# Altium schematic sheet RFFE_Controller.SchDoc
size A3
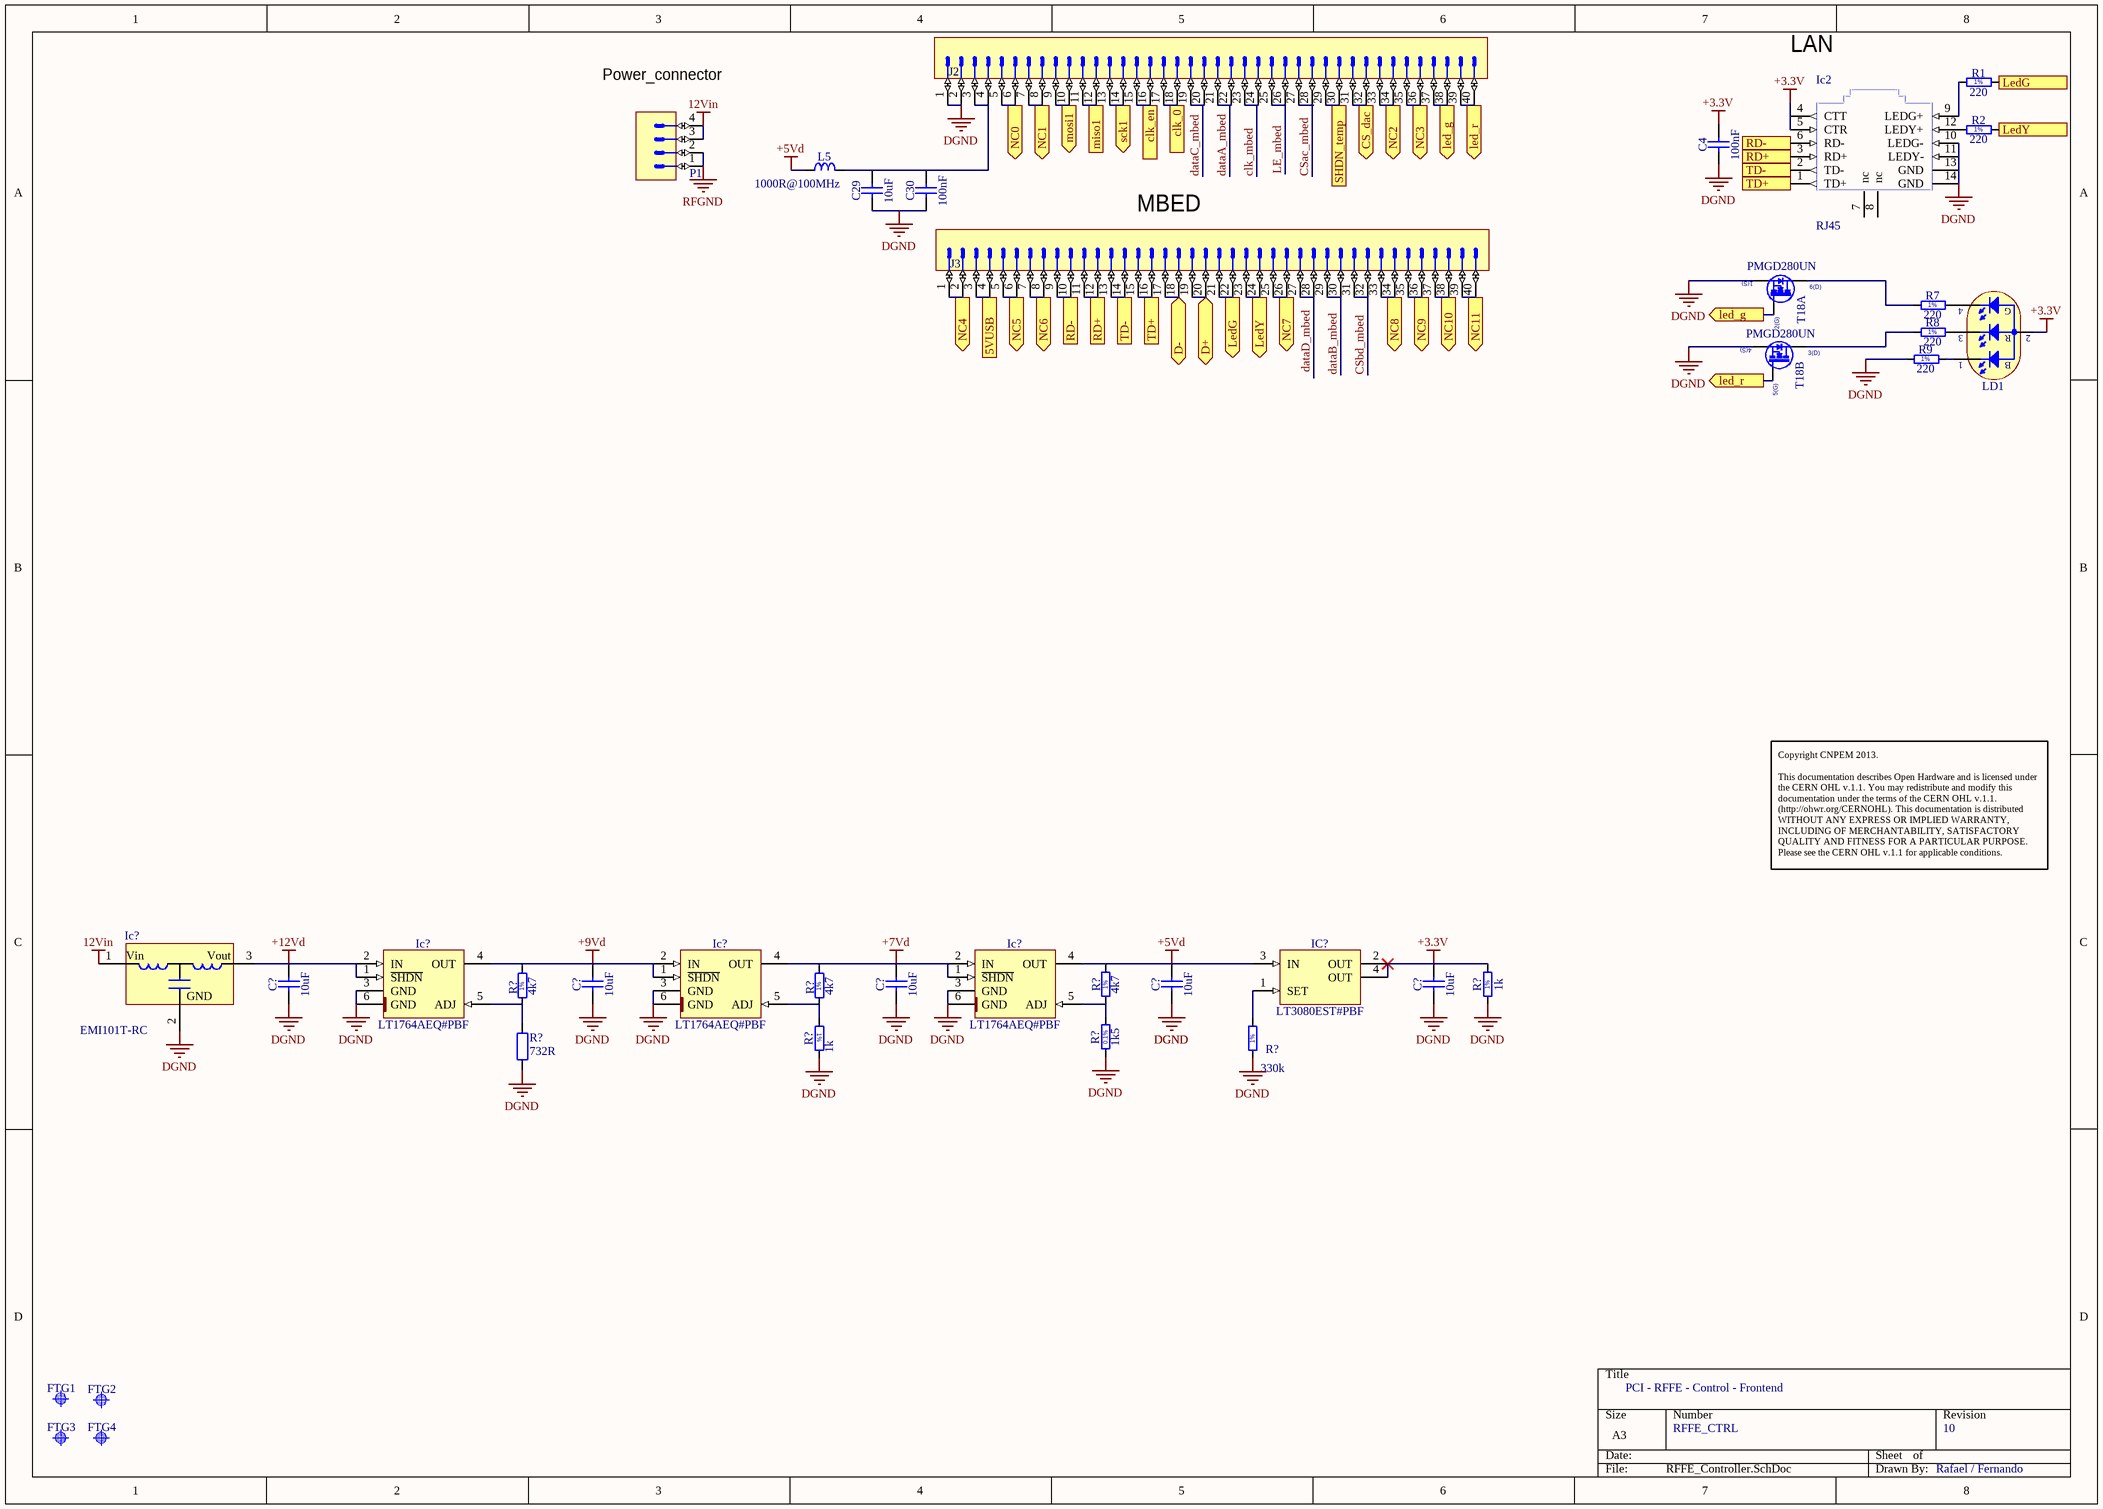
[diagram p0: RFFE_Controller.SchDoc]

## Parts
(Parts that share a designator on the sheet are numbered #1, #2 ... from top to bottom, then left to right.)
C4  100nF  [CAPC1608X87N]
C29  10uF  [CAPC3216X180N]
C30  100nF  [CAPC1608X87N]
C?#1  10uF  [CAPC3216X180N]
C?#2  10uF  [CAPC3216X180N]
C?#3  10uF  [CAPC3216X180N]
C?#4  10uF  [CAPC3216X180N]
C?#5  10uF  [CAPC3216X180N]
FTG1  Use only in PCB  [FIDUCIAL_TOP_S100-200]  (value not drawn)
FTG2  Use only in PCB  [FIDUCIAL_TOP_S100-200]  (value not drawn)
FTG3  Use only in PCB  [FIDUCIAL_TOP_S100-200]  (value not drawn)
FTG4  Use only in PCB  [FIDUCIAL_TOP_S100-200]  (value not drawn)
Ic2  RJ45  [J0006D21BNL]
Ic?#1  LT1764AEQ#PBF  [TO170P1394X457-6N-R900X1060]
Ic?#2  LT1764AEQ#PBF  [TO170P1394X457-6N-R900X1060]
Ic?#3  LT1764AEQ#PBF  [TO170P1394X457-6N-R900X1060]
IC?#4  LT3080EST#PBF  [SOT230P700X180-4N]
Ic?#5  EMI101T-RC  [Filter_EMI_Radial-3]
J2  (no value)  [TYCO_2-534998-0]
J3  (no value)  [TYCO_2-534998-0]
L5  1000R@100MHz  [INDC1608X95N]
LD1  Blue/Red/Green  [LED_AVAGO_HSMF-C113]  (value not drawn)
P1  Header 4  [JST_B4B-XH-A(LF)(SN)]  (value not drawn)
R1  220  [RESC2012X60N]
R2  220  [RESC2012X60N]
R7  220  [RESC2012X60N]
R8  220  [RESC2012X60N]
R9  220  [RESC2012X60N]
R?#1  4k7  [RESC1608X55N]
R?#2  4k7  [RESC1608X55N]
R?#3  4k7  [RESC1608X55N]
R?#4  1k  [RESC1608X55N]
R?#5  1k  [RESC1608X55N]
R?#6  1k5  [RESC2012X60N]
R?#7  330k  [RESC2012X60N]
R?#8  732R
T18  PMGD280UN  [SOT65P210X110-6N]  (parts A,B of 2)

## Ports
5VUSB, clk_0, clk_en, CS_dac (out), D+ (bidir), D- (bidir), led_g (out), led_r (out), LedG, LedG (out), LedY, LedY (out), miso1, mosi1 (out), NC0 (out), NC1 (out), NC2 (out), NC3 (out), NC4 (out), NC5 (out), NC6 (out), NC7 (out), NC8 (out), NC9 (out), NC10 (out), NC11 (out), RD+, RD-, sck1 (out), SHDN_temp, TD+, TD-

## Nets
12Vin: Ic?#5.1(Vin) P1.3 P1.4
+3.3V: C4.2 C?#5.2 Ic2.4(CTT) Ic2.5(CTR) IC?#4.2(OUT) IC?#4.4(OUT) LD1.2(AC) R?#4.2
+5Vd: C?#4.2 Ic?#3.4(OUT) IC?#4.3(IN) L5.1 R?#3.2
+7Vd: C?#3.2 Ic?#2.4(OUT) Ic?#3.1(~{SHDN}) Ic?#3.2(IN) R?#2.2
+9Vd: C?#2.2 Ic?#1.4(OUT) Ic?#2.1(~{SHDN}) Ic?#2.2(IN) R?#1.2
+12Vd: C?#1.2 Ic?#1.1(~{SHDN}) Ic?#1.2(IN) Ic?#5.3(Vout)
DGND: C4.1 C29.1 C30.1 C?#1.1 C?#2.1 C?#3.1 C?#4.1 C?#5.1 Ic2.10(LEDG-) Ic2.11(LEDY-) Ic2.13(GND) Ic2.14(GND) Ic?#1.3(GND) Ic?#1.6(GND) Ic?#2.3(GND) Ic?#2.6(GND) Ic?#3.3(GND) Ic?#3.6(GND) Ic?#5.2(GND) J2.1 J2.2 R9.1 R?#4.1 R?#5.2 R?#6.1 R?#7.1 R?#8.1 T18.1(S) T18.4(S)
RFGND: P1.1 P1.2
5VUSB: J3.3 J3.4 ; port 5VUSB
clk_0: J2.17 J2.18 ; port clk_0
clk_en: J2.15 J2.16 ; port clk_en
clk_mbed: J2.23 J2.24
CS_dac: J2.31 J2.32 ; port CS_dac
CSac_mbed: J2.27 J2.28
CSbd_mbed: J3.31 J3.32
D+: J3.19 J3.20 ; port D+
D-: J3.17 J3.18 ; port D-
dataA_mbed: J2.21 J2.22
dataB_mbed: J3.29 J3.30
dataC_mbed: J2.19 J2.20
dataD_mbed: J3.27 J3.28
LE_mbed: J2.25 J2.26
led_g: J2.37 J2.38 T18.2(G) ; port led_g
led_r: J2.39 J2.40 T18.5(G) ; port led_r
LedG: J3.21 J3.22 R1.2 ; port LedG
LedY: J3.23 J3.24 R2.2 ; port LedY
miso1: J2.11 J2.12 ; port miso1
mosi1: J2.9 J2.10 ; port mosi1
NC0: J2.5 J2.6 ; port NC0
NC1: J2.7 J2.8 ; port NC1
NC2: J2.33 J2.34 ; port NC2
NC3: J2.35 J2.36 ; port NC3
NC4: J3.1 J3.2 ; port NC4
NC5: J3.5 J3.6 ; port NC5
NC6: J3.7 J3.8 ; port NC6
NC7: J3.25 J3.26 ; port NC7
NC8: J3.33 J3.34 ; port NC8
NC9: J3.35 J3.36 ; port NC9
NC10: J3.37 J3.38 ; port NC10
NC11: J3.39 J3.40 ; port NC11
RD+: Ic2.3(RD+) J3.11 J3.12 ; port RD+
RD-: Ic2.6(RD-) J3.9 J3.10 ; port RD-
sck1: J2.13 J2.14 ; port sck1
SHDN_temp: J2.29 J2.30 ; port SHDN_temp
TD+: Ic2.1(TD+) J3.15 J3.16 ; port TD+
TD-: Ic2.2(TD-) J3.13 J3.14 ; port TD-
NetC29_2: C29.2 C30.2 J2.3 J2.4 L5.2
NetIc2_9: Ic2.9(LEDG+) R1.1
NetIc2_12: Ic2.12(LEDY+) R2.1
NetIc?#1_5: Ic?#1.5(ADJ) R?#1.1 R?#8.2
NetIc?#2_5: Ic?#2.5(ADJ) R?#2.1 R?#5.1
NetIc?#3_5: Ic?#3.5(ADJ) R?#3.1 R?#6.2
NetIC?#4_1: IC?#4.1(SET) R?#7.2
NetLD1_1: LD1.1(CB) R9.2
NetLD1_3: LD1.3(CR) R8.2
NetLD1_4: LD1.4(CG) R7.2
NetR7_1: R7.1 T18.6(D)
NetR8_1: R8.1 T18.3(D)

Not connected (* = marked no-connect by the designer): Ic2 7(nc) 8(nc)

## Notes on the sheet
- (near P1) Power_connector
- LAN
- (near J3) MBED
- Copyright CNPEM 2013.
  This documentation describes Open Hardware and is licensed under the CERN OHL v.1.1. You may redistribute and modify this documentation under the terms of the CERN OHL v.1.1. (http://ohwr.org/CERNOHL). This documentation is distributed WITHOUT ANY EXPRESS OR IMPLIED WARRANTY, INCLUDING OF MERCHANTABILITY, SATISFACTORY QUALITY AND FITNESS FOR A PARTICULAR PURPOSE. Please see the CERN OHL v.1.1 for applicable conditions.
- PCI - RFFE - Control - Frontend
- RFFE_CTRL
- 10
- Rafael / Fernando
- (in symbol LED_AVAGO_HSMF-C113) G; R; B
- (in symbol PMGD280UN, part A) 6(D); 1(S); 2(G)
- (in symbol PMGD280UN, part B) 3(D); 4(S); 5(G)
- (in symbol R0603_1K_1%_0.1W_100PPM) 1%
- (in symbol R0603_4K7_1%_0.1W_100PPM) 1%
- (in symbol R0805_1K5_0.1%_0.1W_10PPM) 0.1%
- (in symbol R0805_220R_1%_0.125W_100PPM) 1%
- (in symbol R0805_330K_1%_0.125W_100PPM) 1%

## Library data of the parts
C4 C30 = CC0603_100NF_50V_10%_X7R: Non-polarised capacitor; Manufacturer: GENERIC; Part Description: SMD Multilayer Chip Ceramic Capacitor; Manufacturer1 Part Number: 223858615649; Tolerance: ±10%; Voltage: 50V; TC: X7R; Manufacturer Part Number: CC0603_100NF_50V_10%_X7R; Part Number: CC0603_100NF_50V_10%_X7R; Component Kind: Standard; Component Type: Standard; Pin Count: 2; Value: 100nF; Status: Preferred; Case: 0603; Mounted: Yes; Socket: No; SMD: Yes; Sense: No; Manufacturer1 Example: PHYCOMP; Manufacturer1 ComponentHeight: 0.87mm; HelpURL: \\cern.ch\dfs\Applications\Altium\Datasheets\CC0603_X7R_PHYCOMP.pdf; Author: CERN DEM JLC; CreateDate: 03/12/2007; LatestRevisionDate: 03/12/2007
C29 C?#1-C?#5 = CC1206_10UF_25V_10%_X7R: Non-polarised capacitor; Manufacturer: GENERIC; Part Description: SMD Multilayer Chip Ceramic Capacitor; Manufacturer1 Part Number: C1206C106K4RACTU; Tolerance: ±10%; Voltage: 25V; TC: X7R; Manufacturer Part Number: CC1206_10uF_25V_10%_X7R; Part Number: CC1206_10UF_25V_10%_X7R; Component Kind: Standard; Component Type: Standard; Pin Count: 2; Value: 10uF; Status: Preferred; Case: 1206; Mounted: Yes; Socket: No; SMD: Yes; Sense: No; Manufacturer1 Example: KEMET; Manufacturer1 ComponentHeight: 1.8mm; HelpURL: \\cern.ch\dfs\Applications\Altium\Datasheets\CC1206_X7R_KEMET.pdf; Author: CERN DEM JLC; CreateDate: 12/09/2012; LatestRevisionDate: 12/09/2012
FTG1-FTG4 = FIDUCIAL_TARGET_S100-200: Fiducial Target; Part Description: Square Fiducial Target, Top Layer, 1.0mm, Top Solder 2.0mm, Keepout =2.0mm; Mounted: No; Part Number: FIDUCIAL_TARGET_S100-200; Component Kind: Standard (No BOM); Component Type: Standard (No BOM); Pin Count: 1; Family: Fiducial; Socket: No; SMD: Yes; Sense: No; Status: None; ComponentHeight: 0mm; HelpURL: Undefined; Author: CERN DEM JLC; CreateDate: 09/02/2010; LatestRevisionDate: 04/04/2012; PackageDescription: Square Fiducial Target, Top Layer, 1.0mm, Top Solder 2.0mm, Keepout =2.0mm
Ic2 = J0006D21BNL: CONN MAGJACK 1PORT 100 BASE-TX; Manufacturer: Pulse Electronics Corporation; Part Description: 1 Port, 1x1 Tab-Down 10/100BASE-TX RJ45 FastJack Connector Module With LEDs Y/G; Number of Ports: 1; LED Color: Green - Yellow; Number of Cores per Jack: 4; Shielding: Shielded; Tab Direction: Down; Shield Material: Brass; PressFit: No; Supplier 1: Digi-Key; Manufacturer Part Number: J0006D21BNL; RoHS: RoHS Compliant; Category: Connectors, Interconnects; Stock 1: 1565; Pricing 1: 1=6.38, 25=5.586, 50=5.32, 100=5.054, 250=4.522, 500=4.256, 1000=3.724, 2500=3.5378, 5000=3.458 (USD); Packaging: Bulk; Connector Type: RJ45; Number of Rows: 1; Applications: 10/100 Base-TX, AutoMDIX; Mounting Type: Through Hole; Orientation: 90° Angle (Right); Termination: Solder; Height Above Board: 0.545" (13.84mm); Features: Board Guide; Contact Material: Phosphor Bronze; Contact Finish: Gold; Contact Finish Thickness: 15µin (0.38µm); Housing Material: Thermoplastic; Operating Temperature: 0°C ~ 70°C; ComponentLink1URL: http://productfinder.pulseeng.com/products/datasheets/J403.pdf; ComponentLink1Description: http://productfinder.pulseeng.com/products/datasheets/J403.pdf; Supplier Part Number 1: J0006D21BNL; Part Number: J0006D21BNL; Component Kind: Standard; Component Type: Standard; Pin Count: 16; Family: RJ45; Mounted: Yes; Socket: No; SMD: No; Sense: No; Status: None; ComponentHeight: 13.84mm; HelpURL: http://productfinder.pulseeng.com/products/datasheets/J403.pdf; Author: LNLS DIG FCS; CreateDate: 28/06/2016; LatestRevisionDate: 28/06/2016
Ic?#1-Ic?#3 = LT1764AEQ#PBF: 3A, Fast Transient Response, Low Noise, LDO Regulators; Manufacturer: LINEAR TECHNOLOGY; Part Description: 2.5V 3A, Fast Transient Response, Low Noise, LDO Regulators; PressFit: No; Bonding: No; Manufacturer Part Number: LT1764AEQ#PBF; Part Number: LT1764AEQ#PBF; Component Kind: Standard; Component Type: Standard; Device: LT1764AEQ#PBF; PackageDescription: TO, 1.70mm Pitch; 5 Pin, 13.945mm L X 8.89mm W X 4.572mm H body, IPC Medium Density; Pin Count: 6; Case: TO-263; Mounted: Yes; Socket: No; SMD: Yes; Sense: No; ComponentHeight: 4.57mm; Author: LNLS DIG GBMB; CreateDate: 17/02/2017; LatestRevisionDate: 17/02/2017
IC?#4 = LT3080EST#PBF: 200mA, Programmable Current Source; Part Description: 0 To 36V Adjustable 1.1A Single Resistor Low Dropout Regulator; Manufacturer: LINEAR TECHNOLOGY; PressFit: No; Bonding: No; Part Number: LT3080EST#PBF; Component Kind: Standard; Component Type: Standard; Device: LT3080EST#PBF; PackageDescription: SOT223, 2.30mm pitch; 3 pin, 3.70mm W X 6.70mm L, IPC Medium Density; Manufacturer Part Number: LT3080EST#PBF; Pin Count: 4; Case: SOT223; Mounted: Yes; Socket: No; SMD: Yes; Sense: No; ComponentHeight: 1.8mm; HelpURL: http://cds.linear.com/docs/en/datasheet/3080fc.pdf; Author: LNLS DIG FCS; CreateDate: 04/07/2016; LatestRevisionDate: 04/07/2016
Ic?#5 = EMI101T-RC: FILTER EMI 100PF 350-500MHZ 5A; Manufacturer: Bourns Inc.; Part Description: LC (T-Type) Low Pass Filter 1 Channel 5A 25dB @ 350MHz ~ 500MHz Radial - 3 Leads; Number of Channels: 1; Attenuation Value: 25dB @ 350MHz ~ 500MHz; Resistance - Channel (Ohms): 0.05; Values: C = 100pF; ESD Protection: No; Filter Order: 3rd; PressFit: No; Supplier 1: Digi-Key; RoHS: Vendor undefined; Category: Filters; Stock 1: 15905; Pricing 1: 1=0.27, 10=0.255, 25=0.2428, 50=0.2352, 100=0.2273, 250=0.21552, 500=0.18026, 1000=0.1399 (USD); Packaging: Cut Tape (CT); Type: Low Pass; Package / Case: Radial - 3 Leads; Size / Dimension: 0.354" L x 0.126" W (9.00mm x 3.20mm); Operating Temperature: -25°C ~ 85°C; ComponentLink1URL: http://www.bourns.com/data/global/pdfs/emi_t_series.pdf; ComponentLink1Description: http://www.bourns.com/data/global/pdfs/emi_t_series.pdf; Supplier Part Number 1: EMI_Filter; Manufacturer Part Number: EMI101T-RC; Technology: LC (T-Type); Center / Cutoff Frequency: -; Current: 5A; Applications: General Purpose; Height: 0.315" (8.00mm); Part Number: EMI101T-RC; Component Kind: Standard; Component Type: Standard; Device: EMI101T-RC; PackageDescription: 3 Leads In-Line Package, Pitch 2.54mm; Pin Count: 3; Case: Radial - 3 Leads; Mounted: Yes; Socket: Yes; SMD: No; Sense: No; Bonding: No; ComponentHeight: 8mm; Author: LNLS DIG FCS; HelpURL: http://www.bourns.com/docs/Product-Datasheets/emi_t_series.pdf; CreateDate: 04/07/2016; LatestRevisionDate: 04/07/2016
J2 J3 = TYCO_2-534998-0: Connector 40 Male; Part Description: 40 Contacts, Vertical Low Profile IDC Shrouded Header with Ejection Latches; Manufacturer: TYCO ELECTRONICS; PressFit: No; Part Number: TYCO_2-534998-0; Component Kind: Standard; Component Type: Standard; Pin Count: 40; Family: AMP-LATCH; Mounted: Yes; Socket: No; SMD: No; Sense: No; Status: None; Manufacturer Part Number: 2-534998-0; ComponentHeight: 6.22mm; HelpURL: http://www.te.com/commerce/DocumentDelivery/DDEController?Action=srchrtrv&DocNm=534998&DocType=Customer+Drawing&DocLang=English; Author: LNLS DIG FCS; CreateDate: 28/06/2016; LatestRevisionDate: 28/06/2016
L5 = IND0603_MURATA_BLM18HE102SN1: Inductor; Part Description: SMD EMIFIL Suppression Chip Ferrite Bead; Manufacturer: MURATA; Power: 600mA; Resistance: 0.35R; Tolerance: ±25%; Part Number: IND0603_MURATA_BLM18HE102SN1; Component Kind: Standard; Component Type: Standard; Pin Count: 2; Value: 1000R@100MHz; Status: None; Manufacturer Part Number: BLM18HE102SN1; Case: 0603; Mounted: Yes; Socket: No; SMD: Yes; Sense: No; ComponentHeight: 0.95mm; HelpURL: \\cern.ch\dfs\Applications\Altium\Datasheets\IND0603_MURATA_BLM18H.pdf; Author: CERN DEM JLC; CreateDate: 09/12/2013; LatestRevisionDate: 09/12/2013
LD1 = LED_AVAGO_HSMF-C113: Tricolor LEDs 1 Cathode Blue, 2 Common Anode, 3 Cathode Red, 4 Cathode Green; Part Description: Right Angle Tricolor (Blue, Red, Green) Surface Mount ChipLED; Manufacturer: AVAGO TECHNOLOGIES; PressFit: No; Bonding: No; Part Number: LED_AVAGO_HSMF-C113; Component Kind: Standard; Component Type: Standard; Color: Blue/Red/Green; PackageDescription: Right Angle Tricolor Surface Mount ChipLED, Body 2.5x1mm; Manufacturer Part Number: HSMF-C113; Pin Count: 4; Mounted: Yes; Socket: No; SMD: Yes; Sense: No; ComponentHeight: 1mm; HelpURL: \\cern.ch\dfs\Applications\Altium\Datasheets\LED_AVAGO_HSMF-C113.pdf; Author: CERN DEM JLC; CreateDate: 29/09/2010; LatestRevisionDate: 29/09/2010
P1 = JST_B4B-XH-A(LF)(SN): Connector 4 Male; Part Description: 4 Contacts, 2.5mm Pitch, Top Entry Type Shrouded Header; Manufacturer: JST (JAPAN SOLDERLESS TERMINALS); PressFit: No; LatestRevisionDate: 14/08/2014; Part Number: JST_B4B-XH-A(LF)(SN); Component Kind: Standard; Component Type: Standard; Pin Count: 4; Family: Header 4; Mounted: Yes; Socket: No; SMD: No; Sense: No; Status: None; Manufacturer Part Number: B4B-XH-A(LF)(SN); ComponentHeight: 7mm; HelpURL: \\cern.ch\dfs\Applications\Altium\Datasheets\JST_B4B-XH-A(LF)(SN).pdf; Author: CERN DEM JLC; CreateDate: 14/08/2014
R1 R2 R7-R9 = R0805_220R_1%_0.125W_100PPM: Resistor - 1%; Manufacturer: GENERIC; Part Description: General Purpose Thick Film Chip Resistor; Manufacturer1 Part Number: NRC10F2200TRF; Power: 0.125W; TC: ±100ppm/°C; Manufacturer Part Number: R0805_220R_1%_0.125W_100PPM; Tolerance: ±1%; Part Number: R0805_220R_1%_0.125W_100PPM; Component Kind: Standard; Component Type: Standard; Pin Count: 2; Value: 220; Status: Preferred; Case: 0805; Mounted: Yes; Sense: No; Socket: No; SMD: Yes; Manufacturer1 Example: NIC COMPONENT; Manufacturer1 ComponentHeight: 0.6mm; HelpURL: \\cern.ch\dfs\Applications\Altium\Datasheets\R0805_NIC_NRC.pdf; Author: CERN DEM JLC; CreateDate: 03/12/2007; LatestRevisionDate: 13/03/2008
R?#1-R?#3 = R0603_4K7_1%_0.1W_100PPM: Resistor - 1%; Manufacturer: GENERIC; Part Description: General Purpose Thick Film Chip Resistor; Manufacturer1 Part Number: NRC06F4701TRF; Power: 0.1W; TC: ±100ppm/°C; Manufacturer Part Number: R0603_4K7_1%_0.1W_100PPM; Tolerance: ±1%; Part Number: R0603_4K7_1%_0.1W_100PPM; Component Kind: Standard; Component Type: Standard; Pin Count: 2; Value: 4k7; Status: Preferred; Case: 0603; Mounted: Yes; Sense: No; Socket: No; SMD: Yes; Manufacturer1 Example: NIC COMPONENT; Manufacturer1 ComponentHeight: 0.55mm; HelpURL: \\cern.ch\dfs\Applications\Altium\Datasheets\R0603_NIC_NRC.pdf; Author: CERN DEM JLC; CreateDate: 03/12/2007; LatestRevisionDate: 13/03/2008
R?#4 R?#5 = R0603_1K_1%_0.1W_100PPM: Resistor - 1%; Manufacturer: GENERIC; Part Description: General Purpose Thick Film Chip Resistor; Manufacturer1 Part Number: NRC06F1001TRF; Power: 0.1W; TC: ±100ppm/°C; Manufacturer Part Number: R0603_1K_1%_0.1W_100PPM; Tolerance: ±1%; Part Number: R0603_1K_1%_0.1W_100PPM; Component Kind: Standard; Component Type: Standard; Pin Count: 2; Value: 1k; Status: Preferred; Case: 0603; Mounted: Yes; Sense: No; Socket: No; SMD: Yes; Manufacturer1 Example: NIC COMPONENT; Manufacturer1 ComponentHeight: 0.55mm; HelpURL: \\cern.ch\dfs\Applications\Altium\Datasheets\R0603_NIC_NRC.pdf; Author: CERN DEM JLC; CreateDate: 03/12/2007; LatestRevisionDate: 13/03/2008
R?#6 = R0805_1K5_0.1%_0.1W_10PPM: Resistor - 0.1%; Manufacturer: GENERIC; Part Description: Thin Film Chip Resistor; Manufacturer1 Part Number: RN73C2A1K5BTG; Power: 0.1W; TC: ±10ppm; Manufacturer Part Number: R0805_1K5_0.1%_0.1W_10PPM; Tolerance: ±0.1%; Part Number: R0805_1K5_0.1%_0.1W_10PPM; Component Kind: Standard; Component Type: Standard; Pin Count: 2; Value: 1k5; Status: Not recommended; Case: 0805; Mounted: Yes; Sense: No; Socket: No; SMD: Yes; Manufacturer1 Example: TYCO HOLSWORTHY; Manufacturer1 ComponentHeight: 0.6mm; HelpURL: \\cern.ch\dfs\Applications\Altium\Datasheets\R0805_Tyco_RN73.pdf; Author: CERN DEM JLC; CreateDate: 03/12/2007; LatestRevisionDate: 13/03/2008
R?#7 = R0805_330K_1%_0.125W_100PPM: Resistor - 1%; Manufacturer: GENERIC; Part Description: General Purpose Thick Film Chip Resistor; Manufacturer1 Part Number: NRC10F3303TRF; Power: 0.125W; TC: ±100ppm/°C; Manufacturer Part Number: R0805_330K_1%_0.125W_100PPM; Tolerance: ±1%; Part Number: R0805_330K_1%_0.125W_100PPM; Component Kind: Standard; Component Type: Standard; Pin Count: 2; Value: 330k; Status: Preferred; Case: 0805; Mounted: Yes; Sense: No; Socket: No; SMD: Yes; Manufacturer1 Example: NIC COMPONENT; Manufacturer1 ComponentHeight: 0.6mm; HelpURL: \\cern.ch\dfs\Applications\Altium\Datasheets\R0805_NIC_NRC.pdf; Author: CERN DEM JLC; CreateDate: 03/12/2007; LatestRevisionDate: 13/03/2008
R?#8 = RC0402FR-07732RL: Thick Film Resistors - SMD 732 OHM 1%; Manufacturer 1: Yageo; Temperature Coefficient: 100ppm/°C; Power Rating: 62.5mW; Voltage Rating: 50V; Max Power Dissipation: 63mW; Supplier 1: Digi-Key; Manufacturer Part Number 1: RC0402FR-07732RL; Stock 1: 265983; Pricing 1: 1=0,10000, 10=0,01600, 100=0,00640, 1000=0,00289, 2500=0,00251, 5000=0,00207 (USD); RoHS: Yes; Case/Package: 0402; Contact Plating: Tin,Matte; Case Code (Imperial): 0402; Case Code (Metric): 1005; Min Operating Temperature: -55°C; Max Operating Temperature: 155°C; Resistance: 732R; Tolerance: 1%; Composition: Thick Film; Packaging: Tape and Reel; Number of Terminations: 2; Termination: SMD/SMT; Military Standard: Not; Voltage Rating (DC): 50V; Features: Moisture Resistant; Length: 1mm; Height: 0.016inch; Width: 0.02inch; Depth: 0.5mm; ComponentLink1URL: https://datasheet.ciiva.com/28388/pyu-rc0402-51-rohs-l-6-28388230.pdf?src-supplier=Avnet+Europe; ComponentLink1Description: https://datasheet.ciiva.com/28388/pyu-rc0402-51-rohs-l-6-28388230.pdf?src-supplier=Avnet+Europe; ComponentLink2URL: https://datasheet.ciiva.com/5595/pyu-rc0402-51-rohs-l-6-r-8721-5595967.pdf?src-supplier=Mouser; ComponentLink2Description: https://datasheet.ciiva.com/5595/pyu-rc0402-51-rohs-l-6-r-8721-5595967.pdf?src-supplier=Mouser; Supplier Part Number 1: YAG3225CT-ND
T18 = PMGD280UN: Dual N-Channel micro TrenchMOS™ Ultra Low Level FET; Part Description: 20V 870mA Dual N-Channel micro TrenchMOS™ Ultra Low Level FET; Manufacturer: NXP SEMICONDUCTORS; PressFit: No; Bonding: No; Part Number: PMGD280UN; Component Kind: Standard; Component Type: Standard; Device: PMGD280UN; PackageDescription: SOT363, SC70-6, SOT, 0.65mm Pitch, 6 pin, 1.25mm W X 2.00mm L X 1.10mm H, IPC Medium Density; Manufacturer Part Number: PMGD280UN; Pin Count: 6; Case: SOT363; Mounted: Yes; Socket: No; SMD: Yes; Sense: No; ComponentHeight: 1.1mm; HelpURL: \\cern.ch\dfs\Applications\Altium\Datasheets\PMGD280UN.pdf; Author: CERN DEM JLC; CreateDate: 19/11/2014; LatestRevisionDate: 19/11/2014